# EAGLE schematic SONAR_SCH (EAGLE 9.6.2)
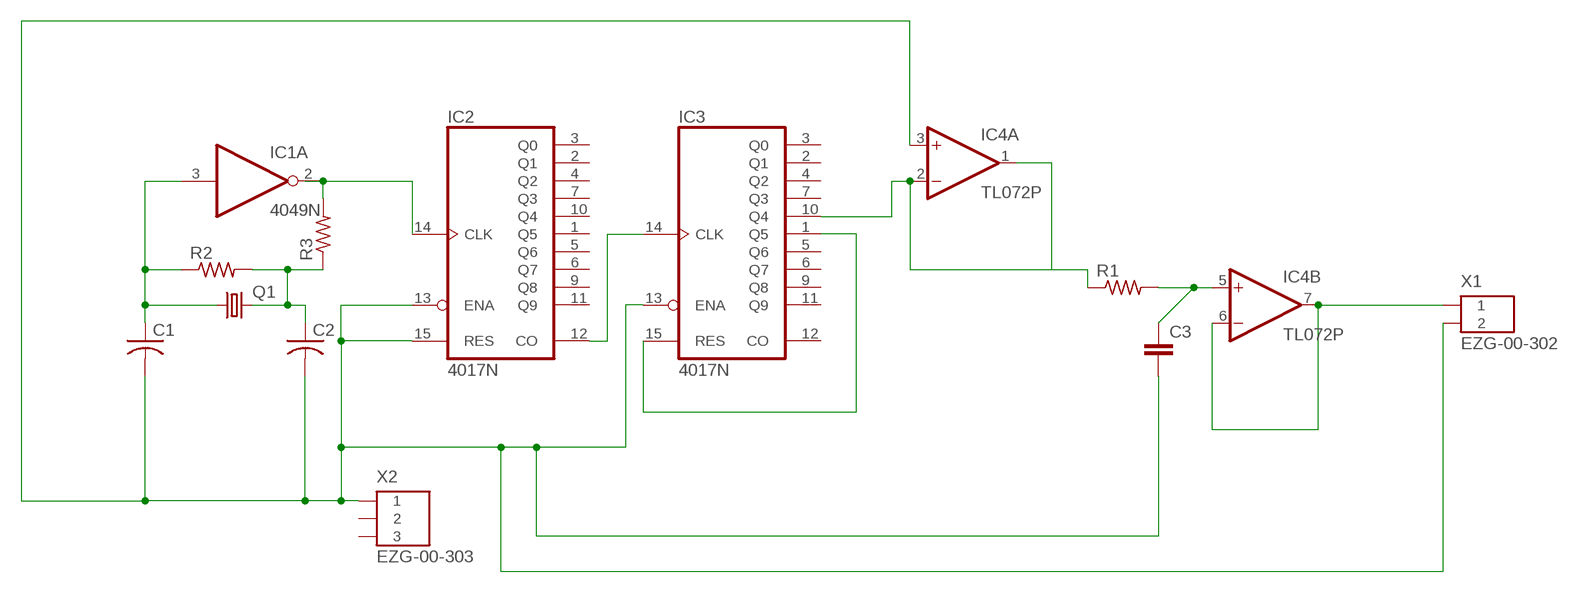
[diagram p0: schematic, sheet 1]

## Parts
C1  C-US050-025X075  [C050-025X075]
C2  C-US050-025X075  [C050-025X075]
C3  C2.5/2  [C2.5-2]
IC1  4049N  [DIL16]
IC2  4017N  [DIL16]
IC3  4017N  [DIL16]
IC4  TL072P  [DIL08]
Q1  CRYSTALHC49U-V  [HC49U-V]
R1  R-US_0207/10  [0207/10]
R2  R-US_0207/10  [0207/10]
R3  R-US_0207/10  [0207/10]
X1  EZG-00-302  [EZG-00-302]
X2  EZG-00-303  [EZG-00-303]

## Nets
N$1: C1.1 IC1.3(A:I) Q1.1 R2.1
N$2: IC1.2(A:O) IC2.14(CLK) R3.2
N$3: IC2.12(CO) IC3.14(CLK)
N$4: IC3.10(Q4) IC4.1(A:OUT) IC4.2(A:-IN) R1.1
N$5: IC3.1(Q5) IC3.15(RES)
N$6: C3.1 IC4.5(B:+IN) R1.2
N$7: IC4.6(B:-IN) IC4.7(B:OUT) X1.1
N$8: C1.2 C2.2 C3.2 IC2.13(ENA) IC2.15(RES) IC3.13(ENA) IC4.3(A:+IN) X1.2 X2.1
N$9: C2.1 Q1.2 R2.2 R3.1
Unconnected: IC1.4(B:O) IC1.5(B:I) IC1.6(C:O) IC1.7(C:I) IC1.9(D:I) IC1.10(D:O) IC1.11(E:I) IC1.12(E:O) IC1.14(F:I) IC1.15(F:O) IC2.1(Q5) IC2.2(Q1) IC2.3(Q0) IC2.4(Q2) IC2.5(Q6) IC2.6(Q7) IC2.7(Q3) IC2.9(Q8) IC2.10(Q4) IC2.11(Q9) IC3.2(Q1) IC3.3(Q0) IC3.4(Q2) IC3.5(Q6) IC3.6(Q7) IC3.7(Q3) IC3.9(Q8) IC3.11(Q9) IC3.12(CO) X2.2 X2.3

## Power pins joined to a net without a drawn wire
V+: IC4.8(P:V+)
V-: IC4.4(P:V-)
VDD: IC1.1(P:VDD) IC2.16(VDD) IC3.16(VDD)
VSS: IC1.8(P:VSS) IC2.8(VSS) IC3.8(VSS)

## Library data of the parts
C1 C2 = rcl:C-US: CAPACITOR, American symbol; SPICEPREFIX: C
C3 = capacitor-wima:C: CAPACITOR naming: grid - package width
IC1 = 40xx:4049: Hex inverting BUFFER
IC2 IC3 = 40xx:4017: COUNTER/DIVIDER
IC4 = linear:TL072: OP AMP
Q1 = crystal:CRYSTAL: CRYSTAL; OC_FARNELL: 1666969; OC_NEWARK: unknown
R1-R3 = rcl:R-US_: RESISTOR, American symbol; SPICEPREFIX: R
X1 = con-lemo:EZG-?-302: LEMO Connector Source: http://www.lemo.com/pdfs/catalog/ROW/German/unipole_multipole.pdf; OC_FARNELL: unknown; OC_NEWARK: unknown
X2 = con-lemo:EZG-?-303: LEMO Connector Source: http://www.lemo.com/pdfs/catalog/ROW/German/unipole_multipole.pdf; OC_FARNELL: unknown; OC_NEWARK: unknown